# EAGLE design stepstick (EAGLE 5.11)
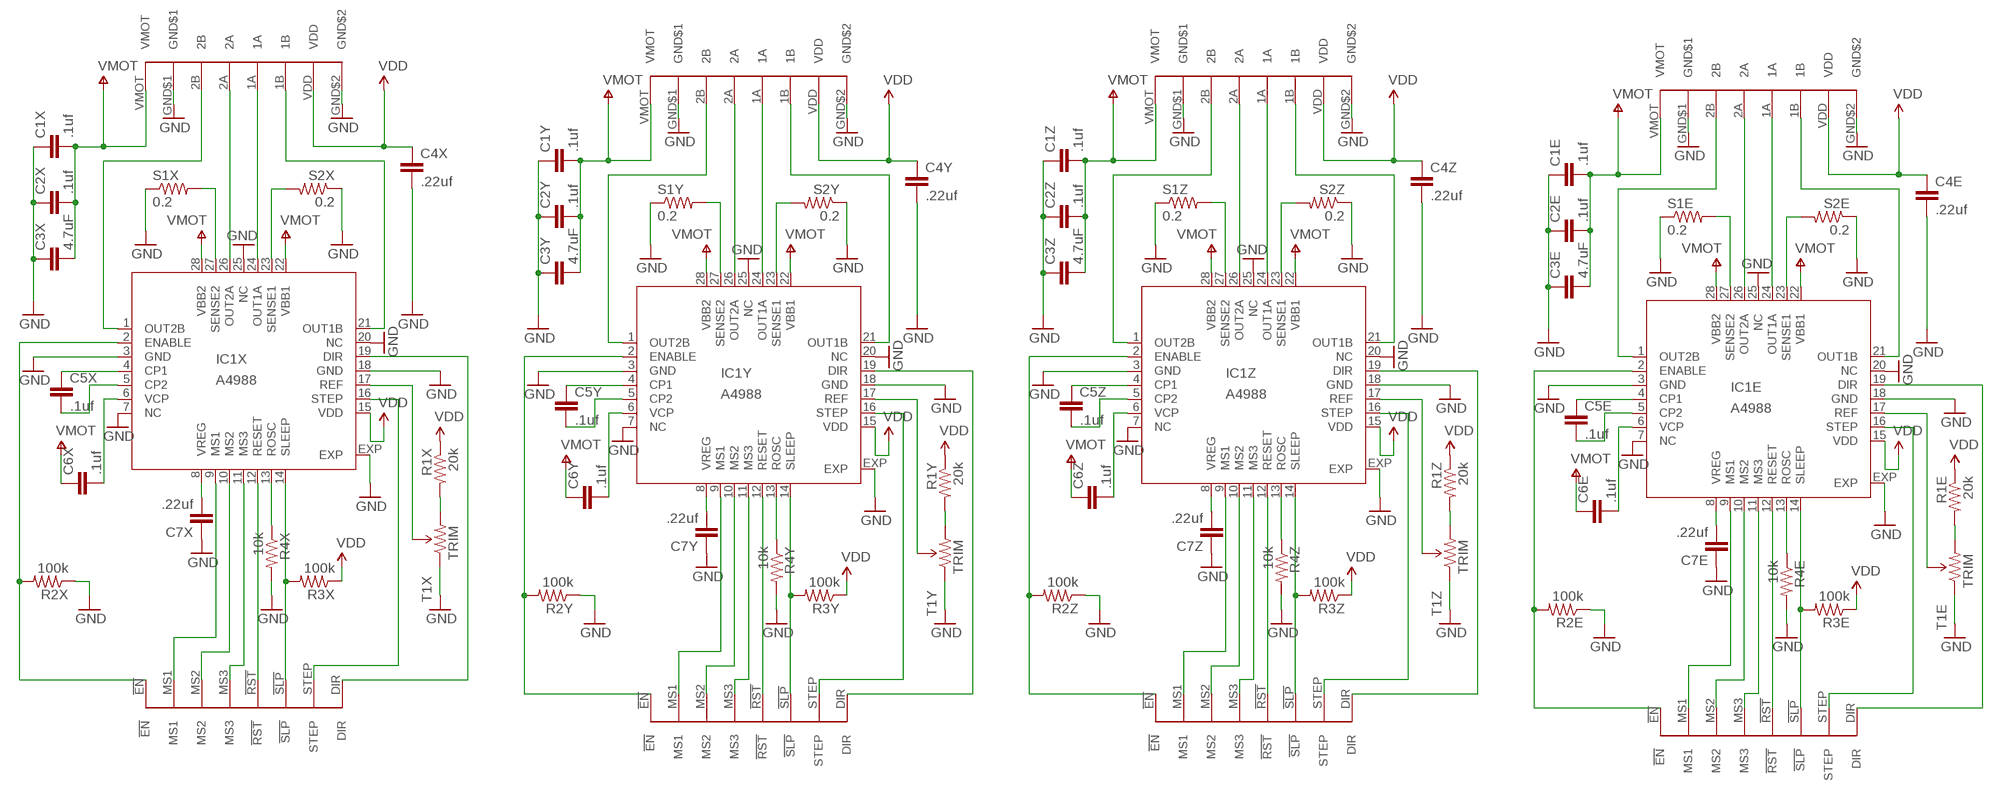
[diagram p0: schematic, sheet 1]

## Parts
C1E  .1uf  CAP0402-CAP  [0402-CAP]
C1X  .1uf  CAP0402-CAP  [0402-CAP]
C1Y  .1uf  CAP0402-CAP  [0402-CAP]
C1Z  .1uf  CAP0402-CAP  [0402-CAP]
C2E  .1uf  CAP0402-CAP  [0402-CAP]
C2X  .1uf  CAP0402-CAP  [0402-CAP]
C2Y  .1uf  CAP0402-CAP  [0402-CAP]
C2Z  .1uf  CAP0402-CAP  [0402-CAP]
C3E  4.7uF  CAP1206  [1206]
C3X  4.7uF  CAP1206  [1206]
C3Y  4.7uF  CAP1206  [1206]
C3Z  4.7uF  CAP1206  [1206]
C4E  .22uf  CAP0402-CAP  [0402-CAP]
C4X  .22uf  CAP0402-CAP  [0402-CAP]
C4Y  .22uf  CAP0402-CAP  [0402-CAP]
C4Z  .22uf  CAP0402-CAP  [0402-CAP]
C5E  .1uf  CAP0402-CAP  [0402-CAP]
C5X  .1uf  CAP0402-CAP  [0402-CAP]
C5Y  .1uf  CAP0402-CAP  [0402-CAP]
C5Z  .1uf  CAP0402-CAP  [0402-CAP]
C6E  .1uf  CAP0402-CAP  [0402-CAP]
C6X  .1uf  CAP0402-CAP  [0402-CAP]
C6Y  .1uf  CAP0402-CAP  [0402-CAP]
C6Z  .1uf  CAP0402-CAP  [0402-CAP]
C7E  .22uf  CAP0402-CAP  [0402-CAP]
C7X  .22uf  CAP0402-CAP  [0402-CAP]
C7Y  .22uf  CAP0402-CAP  [0402-CAP]
C7Z  .22uf  CAP0402-CAP  [0402-CAP]
IC1E  A4988  A4983  [QFN28ET]
IC1X  A4988  A4983  [QFN28ET]
IC1Y  A4988  A4983  [QFN28ET]
IC1Z  A4988  A4983  [QFN28ET]
J1E  CLONOLU  [CLONOLU]
J1X  CLONOLU  [CLONOLU]
J1Y  CLONOLU  [CLONOLU]
J1Z  CLONOLU  [CLONOLU]
R1E  20k  RESISTOR0402-RES  [0402-RES]
R1X  20k  RESISTOR0402-RES  [0402-RES]
R1Y  20k  RESISTOR0402-RES  [0402-RES]
R1Z  20k  RESISTOR0402-RES  [0402-RES]
R2E  100k  RESISTOR0402-RES  [0402-RES]
R2X  100k  RESISTOR0402-RES  [0402-RES]
R2Y  100k  RESISTOR0402-RES  [0402-RES]
R2Z  100k  RESISTOR0402-RES  [0402-RES]
R3E  100k  RESISTOR0402-RES  [0402-RES]
R3X  100k  RESISTOR0402-RES  [0402-RES]
R3Y  100k  RESISTOR0402-RES  [0402-RES]
R3Z  100k  RESISTOR0402-RES  [0402-RES]
R4E  10k  RESISTOR0402-RES  [0402-RES]
R4X  10k  RESISTOR0402-RES  [0402-RES]
R4Y  10k  RESISTOR0402-RES  [0402-RES]
R4Z  10k  RESISTOR0402-RES  [0402-RES]
S1E  0.2  RESISTOR  [0805]
S1X  0.2  RESISTOR  [0805]
S1Y  0.2  RESISTOR  [0805]
S1Z  0.2  RESISTOR  [0805]
S2E  0.2  RESISTOR  [0805]
S2X  0.2  RESISTOR  [0805]
S2Y  0.2  RESISTOR  [0805]
S2Z  0.2  RESISTOR  [0805]
T1E  TRIM  TRIMPOTSMD  [TRIMPOT-3MM]
T1X  TRIM  TRIMPOTSMD  [TRIMPOT-3MM]
T1Y  TRIM  TRIMPOTSMD  [TRIMPOT-3MM]
T1Z  TRIM  TRIMPOTSMD  [TRIMPOT-3MM]

## Nets
ECP1: C5E.1 IC1E.4(CP1)
ECP2: C5E.2 IC1E.5(CP2)
EDIR: IC1E.19(DIR) J1E.DIR(A4983$1:DIR)
EENABLE: IC1E.2(ENABLE) J1E.!EN(A4983$1:!EN) R2E.2
EMS1: IC1E.9(MS1) J1E.MS1(A4983$1:MS1)
EMS2: IC1E.10(MS2) J1E.MS2(A4983$1:MS2)
EMS3: IC1E.11(MS3) J1E.MS3(A4983$1:MS3)
EOUT1A: IC1E.24(OUT1A) J1E.1A(A4983$2:1A)
EOUT1B: IC1E.21(OUT1B) J1E.1B(A4983$2:1B)
EOUT2A: IC1E.26(OUT2A) J1E.2A(A4983$2:2A)
EOUT2B: IC1E.1(OUT2B) J1E.2B(A4983$2:2B)
EREF: IC1E.17(REF) T1E.2(WIPER)
EREF2: R1E.2 T1E.3(CW)
ERESET: IC1E.12(RESET) J1E.!RST(A4983$1:!RST)
EROSC: IC1E.13(ROSC) R4E.1
ESENSE1: IC1E.23(SENSE1) S2E.2
ESENSE2: IC1E.27(SENSE2) S1E.2
ESLEEP: IC1E.14(SLEEP) J1E.!SLP(A4983$1:!SLP) R3E.2
ESTEP: IC1E.16(STEP) J1E.STEP(A4983$1:STEP)
EVCP: C6E.2 IC1E.6(VCP)
EVREG: C7E.2 IC1E.8(VREG)
GND: C1E.1 C1X.1 C1Y.1 C1Z.1 C2E.1 C2X.1 C2Y.1 C2Z.1 C3E.1 C3X.1 C3Y.1 C3Z.1 C4E.2 C4X.2 C4Y.2 C4Z.2 C7E.1 C7X.1 C7Y.1 C7Z.1 IC1E.3(GND) IC1E.7(NC) IC1E.18(GND) IC1E.20(NC) IC1E.25(NC) IC1E.EXP IC1X.3(GND) IC1X.7(NC) IC1X.18(GND) IC1X.20(NC) IC1X.25(NC) IC1X.EXP IC1Y.3(GND) IC1Y.7(NC) IC1Y.18(GND) IC1Y.20(NC) IC1Y.25(NC) IC1Y.EXP IC1Z.3(GND) IC1Z.7(NC) IC1Z.18(GND) IC1Z.20(NC) IC1Z.25(NC) IC1Z.EXP J1E.GND$1(A4983$2:GND$1) J1E.GND$2(A4983$2:GND$2) J1X.GND$1(A4983$2:GND$1) J1X.GND$2(A4983$2:GND$2) J1Y.GND$1(A4983$2:GND$1) J1Y.GND$2(A4983$2:GND$2) J1Z.GND$1(A4983$2:GND$1) J1Z.GND$2(A4983$2:GND$2) R2E.1 R2X.1 R2Y.1 R2Z.1 R4E.2 R4X.2 R4Y.2 R4Z.2 S1E.1 S1X.1 S1Y.1 S1Z.1 S2E.1 S2X.1 S2Y.1 S2Z.1 T1E.1(CCW) T1X.1(CCW) T1Y.1(CCW) T1Z.1(CCW)
VDD: C4E.1 C4X.1 C4Y.1 C4Z.1 IC1E.15(VDD) IC1X.15(VDD) IC1Y.15(VDD) IC1Z.15(VDD) J1E.VDD(A4983$2:VDD) J1X.VDD(A4983$2:VDD) J1Y.VDD(A4983$2:VDD) J1Z.VDD(A4983$2:VDD) R1E.1 R1X.1 R1Y.1 R1Z.1 R3E.1 R3X.1 R3Y.1 R3Z.1
VMOT: C1E.2 C1X.2 C1Y.2 C1Z.2 C2E.2 C2X.2 C2Y.2 C2Z.2 C3E.2 C3X.2 C3Y.2 C3Z.2 C6E.1 C6X.1 C6Y.1 C6Z.1 IC1E.22(VBB1) IC1E.28(VBB2) IC1X.22(VBB1) IC1X.28(VBB2) IC1Y.22(VBB1) IC1Y.28(VBB2) IC1Z.22(VBB1) IC1Z.28(VBB2) J1E.VMOT(A4983$2:VMOT) J1X.VMOT(A4983$2:VMOT) J1Y.VMOT(A4983$2:VMOT) J1Z.VMOT(A4983$2:VMOT)
XCP1: C5X.1 IC1X.4(CP1)
XCP2: C5X.2 IC1X.5(CP2)
XDIR: IC1X.19(DIR) J1X.DIR(A4983$1:DIR)
XENABLE: IC1X.2(ENABLE) J1X.!EN(A4983$1:!EN) R2X.2
XMS1: IC1X.9(MS1) J1X.MS1(A4983$1:MS1)
XMS2: IC1X.10(MS2) J1X.MS2(A4983$1:MS2)
XMS3: IC1X.11(MS3) J1X.MS3(A4983$1:MS3)
XOUT1A: IC1X.24(OUT1A) J1X.1A(A4983$2:1A)
XOUT1B: IC1X.21(OUT1B) J1X.1B(A4983$2:1B)
XOUT2A: IC1X.26(OUT2A) J1X.2A(A4983$2:2A)
XOUT2B: IC1X.1(OUT2B) J1X.2B(A4983$2:2B)
XOUT2B1: IC1Y.1(OUT2B) J1Y.2B(A4983$2:2B)
XREF: IC1X.17(REF) T1X.2(WIPER)
XREF2: R1X.2 T1X.3(CW)
XRESET: IC1X.12(RESET) J1X.!RST(A4983$1:!RST)
XROSC: IC1X.13(ROSC) R4X.1
XSENSE1: IC1X.23(SENSE1) S2X.2
XSENSE2: IC1X.27(SENSE2) S1X.2
XSLEEP: IC1X.14(SLEEP) J1X.!SLP(A4983$1:!SLP) R3X.2
XSTEP: IC1X.16(STEP) J1X.STEP(A4983$1:STEP)
XVCP: C6X.2 IC1X.6(VCP)
XVREG: C7X.2 IC1X.8(VREG)
YCP1: C5Y.1 IC1Y.4(CP1)
YCP2: C5Y.2 IC1Y.5(CP2)
YDIR1: IC1Y.19(DIR) J1Y.DIR(A4983$1:DIR)
YENABLE: IC1Y.2(ENABLE) J1Y.!EN(A4983$1:!EN) R2Y.2
YMS1: IC1Y.9(MS1) J1Y.MS1(A4983$1:MS1)
YMS2: IC1Y.10(MS2) J1Y.MS2(A4983$1:MS2)
YMS3: IC1Y.11(MS3) J1Y.MS3(A4983$1:MS3)
YOUT1A: IC1Y.24(OUT1A) J1Y.1A(A4983$2:1A)
YOUT1B: IC1Y.21(OUT1B) J1Y.1B(A4983$2:1B)
YOUT2A: IC1Y.26(OUT2A) J1Y.2A(A4983$2:2A)
YREF: IC1Y.17(REF) T1Y.2(WIPER)
YREF1: R1Y.2 T1Y.3(CW)
YRESET: IC1Y.12(RESET) J1Y.!RST(A4983$1:!RST)
YROSC: IC1Y.13(ROSC) R4Y.1
YSENSE1: IC1Y.23(SENSE1) S2Y.2
YSENSE2: IC1Y.27(SENSE2) S1Y.2
YSLEEP: IC1Y.14(SLEEP) J1Y.!SLP(A4983$1:!SLP) R3Y.2
YSTEP: IC1Y.16(STEP) J1Y.STEP(A4983$1:STEP)
YVCP: C6Y.2 IC1Y.6(VCP)
YVREG: C7Y.2 IC1Y.8(VREG)
ZCP1: C5Z.1 IC1Z.4(CP1)
ZCP2: C5Z.2 IC1Z.5(CP2)
ZDIR: IC1Z.19(DIR) J1Z.DIR(A4983$1:DIR)
ZENABLE: IC1Z.2(ENABLE) J1Z.!EN(A4983$1:!EN) R2Z.2
ZMS1: IC1Z.9(MS1) J1Z.MS1(A4983$1:MS1)
ZMS2: IC1Z.10(MS2) J1Z.MS2(A4983$1:MS2)
ZMS3: IC1Z.11(MS3) J1Z.MS3(A4983$1:MS3)
ZOUT1A: IC1Z.24(OUT1A) J1Z.1A(A4983$2:1A)
ZOUT1B: IC1Z.21(OUT1B) J1Z.1B(A4983$2:1B)
ZOUT2A: IC1Z.26(OUT2A) J1Z.2A(A4983$2:2A)
ZOUT2B: IC1Z.1(OUT2B) J1Z.2B(A4983$2:2B)
ZREF: IC1Z.17(REF) T1Z.2(WIPER)
ZREF2: R1Z.2 T1Z.3(CW)
ZRESET: IC1Z.12(RESET) J1Z.!RST(A4983$1:!RST)
ZROSC: IC1Z.13(ROSC) R4Z.1
ZSENSE1: IC1Z.23(SENSE1) S2Z.2
ZSENSE2: IC1Z.27(SENSE2) S1Z.2
ZSLEEP: IC1Z.14(SLEEP) J1Z.!SLP(A4983$1:!SLP) R3Z.2
ZSTEP: IC1Z.16(STEP) J1Z.STEP(A4983$1:STEP)
ZVCP: C6Z.2 IC1Z.6(VCP)
ZVREG: C7Z.2 IC1Z.8(VREG)

## Library data of the parts
C1E C1X C1Y C1Z C2E C2X C2Y C2Z C3E C3X C3Y C3Z C4E C4X C4Y C4Z C5E C5X C5Y C5Z C6E C6X C6Y C6Z C7E C7X C7Y C7Z = SparkFun:CAP: Capacitor Standard 0603 ceramic capacitor, and 0.1" leaded capacitor.
IC1E IC1X IC1Y IC1Z = allegro:A4983: DMOS Microstepping Driver with Translator Auto generated by make-symbol-device-package-bsdl.ulp Rev. 32 Source: http://www.allegromicro.com/en/Products/Part_Numbers/4983/4983.pdf; MPN: A4983SETTR-T; OC_FARNELL: 1688956; OC_NEWARK: 39M6763
J1E J1X J1Y J1Z = pololu-allegro:CLONOLU
R1E R1X R1Y R1Z R2E R2X R2Y R2Z R3E R3X R3Y R3Z R4E R4X R4Y R4Z S1E S1X S1Y S1Z S2E S2X S2Y S2Z = SparkFun:RESISTOR: Resistor Basic schematic elements and footprints for 0603, 1206, and PTH 1/10th watt (small) resistors.
T1E T1X T1Y T1Z = SparkFun:TRIMPOT

## Board
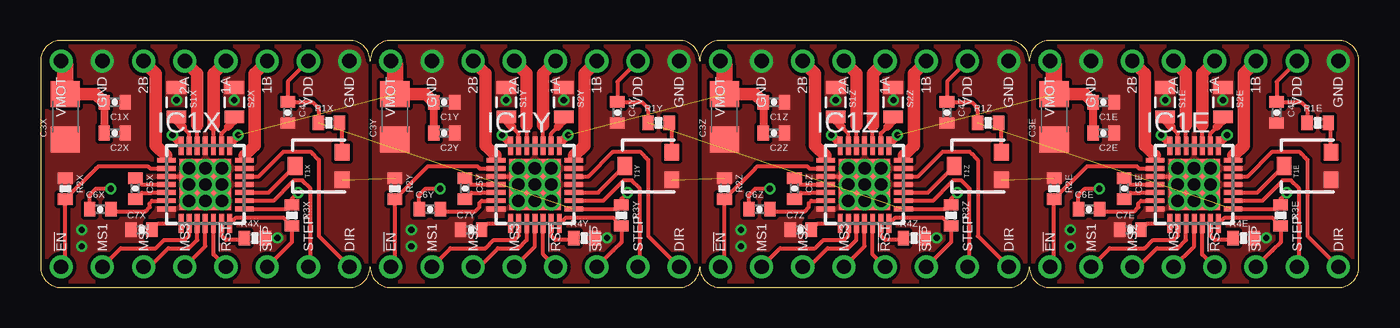
[diagram p1: board, top side]
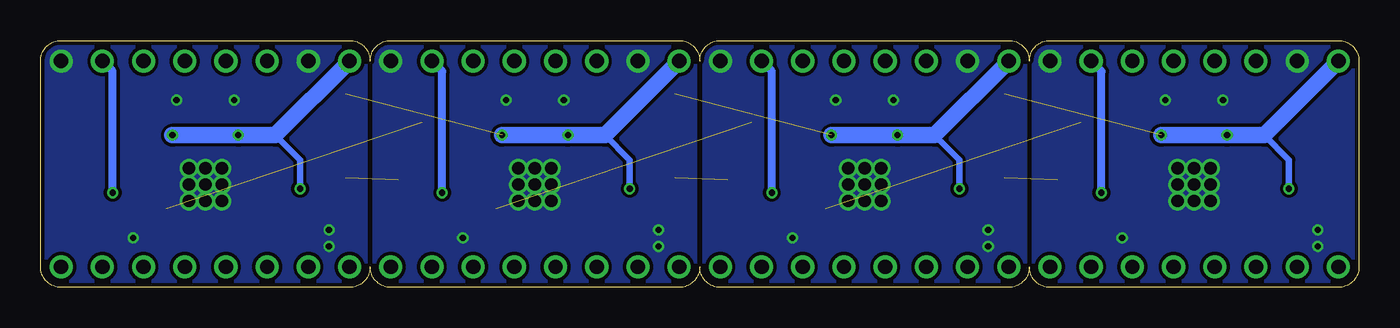
[diagram p2: board, bottom side, seen from below]

Size 81.28 x 15.24 mm. Coordinates in mm from the lower left corner, seen from the top.
Outline: 1.27,15.24 arc90 0,13.97 0,1.27 arc90 1.27,0 19.05,0 arc90 20.32,1.27 arc90 21.59,0 39.37,0 arc90 40.64,1.27 arc90 41.91,0 59.69,0 arc90 60.96,1.27 arc90 62.23,0 80.01,0 arc90 81.28,1.27 81.28,13.97 arc90 80.01,15.24 62.23,15.24 arc90 60.96,13.97 arc90 59.69,15.24 41.91,15.24 arc90 40.64,13.97 arc90 39.37,15.24 21.59,15.24 arc90 20.32,13.97 arc90 19.05,15.24 1.27,15.24
Copper layers (1*16): Top 0.035mm / dielectric 1.5mm / Bottom 0.035mm
Design rules "ITead_rule *": minimum track width 8mil, minimum drill 12mil, track to track 8mil, track to pad 8mil, pad to pad 7mil, via to via 8mil, smd to smd 0mil, copper to edge 10mil, drill to drill 10mil, minimum pad ring 10mil, minimum via ring 6mil, stop-mask expansion 2mil, vias tented up to drill 100mil, thermal gap 10mil

### Footprints (pad centres in the part's own frame; a part is rotated, then mirrored left to right if it is on the bottom)
0402-CAP = smd 0.7 x 0.9: 1 -0.65,0; 2 0.65,0
1206 = smd 1.6 x 1.8: 1 -1.4,0; 2 1.4,0
QFN28ET = smd 1.15 x 0.3: 1 -2.4,1.5; 2 -2.4,1; 3 -2.4,0.5; 4 -2.4,0; 5 -2.4,-0.5; 6 -2.4,-1; 7 -2.4,-1.5; 15 2.4,-1.5; 16 2.4,-1; 17 2.4,-0.5; 18 2.4,0; 19 2.4,0.5; 20 2.4,1; 21 2.4,1.5 | smd 0.3 x 1.15: 8 -1.5,-2.4; 9 -1,-2.4; 10 -0.5,-2.4; 11 0,-2.4; 12 0.5,-2.4; 13 1,-2.4; 14 1.5,-2.4; 22 1.5,2.4; 23 1,2.4; 24 0.5,2.4; 25 0,2.4; 26 -0.5,2.4; 27 -1,2.4; 28 -1.5,2.4 | smd 3.15 x 3.15: EXP 0,0
CLONOLU = drill 0.889 pad 1.422 round: 1A 6.35,-1.27; 1B 6.35,-3.81; 2A 6.35,1.27; 2B 6.35,3.81; !EN -6.35,8.89; !RST -6.35,-1.27; !SLP -6.35,-3.81; DIR -6.35,-8.89; GND$1 6.35,6.35; GND$2 6.35,-8.89; MS1 -6.35,6.35; MS2 -6.35,3.81; MS3 -6.35,1.27; STEP -6.35,-6.35; VDD 6.35,-6.35; VMOT 6.35,8.89
0402-RES = smd 0.7 x 0.9: 1 -0.65,0; 2 0.65,0
0805 = smd 0.8 x 1.2: 1 -0.9,0; 2 0.9,0
TRIMPOT-3MM = smd 1 x 0.9: 1 -0.85,-1.45; 3 0.85,-1.45 | smd 1.1 x 0.9: 2 0,1.45

### Placement (x,y rotation side)
C1E  65.53,11.43 180 top
C1X  4.57,11.43 180 top
C1Y  24.89,11.43 180 top
C1Z  45.21,11.43 180 top
C2E  65.53,9.53 180 top
C2X  4.57,9.53 180 top
C2Y  24.89,9.53 180 top
C2Z  45.21,9.53 180 top
C3E  62.48,10.54 90 top
C3X  1.52,10.54 90 top
C3Y  21.84,10.54 90 top
C3Z  42.16,10.54 90 top
C4E  76.2,10.79 270 top
C4X  15.24,10.79 270 top
C4Y  35.56,10.79 270 top
C4Z  55.88,10.79 270 top
C5E  66.8,6.1 270 top
C5X  5.84,6.1 270 top
C5Y  26.16,6.1 270 top
C5Z  46.48,6.1 270 top
C6E  64.64,4.83 0 top
C6X  3.68,4.83 0 top
C6Y  24,4.83 0 top
C6Z  44.32,4.83 0 top
C7E  67.18,3.56 0 top
C7X  6.22,3.56 0 top
C7Y  26.54,3.56 0 top
C7Z  46.86,3.56 0 top
IC1E  71.12,6.35 0 top
IC1X  10.16,6.35 0 top
IC1Y  30.48,6.35 0 top
IC1Z  50.8,6.35 0 top
J1E  71.12,7.62 90 top
J1X  10.16,7.62 90 top
J1Y  30.48,7.62 90 top
J1Z  50.8,7.62 90 top
R1E  78.74,10.16 0 top
R1X  17.78,10.16 0 top
R1Y  38.1,10.16 0 top
R1Z  58.42,10.16 0 top
R2E  62.48,6.1 270 top
R2X  1.52,6.1 270 top
R2Y  21.84,6.1 270 top
R2Z  42.16,6.1 270 top
R3E  76.45,4.45 270 top
R3X  15.49,4.45 270 top
R3Y  35.81,4.45 270 top
R3Z  56.13,4.45 270 top
R4E  74.17,3.05 0 top
R4X  13.21,3.05 0 top
R4Y  33.53,3.05 0 top
R4Z  53.85,3.05 0 top
S1E  69.34,11.43 270 top
S1X  8.38,11.43 270 top
S1Y  28.7,11.43 270 top
S1Z  49.02,11.43 270 top
S2E  72.9,11.43 270 top
S2X  11.94,11.43 270 top
S2Y  32.26,11.43 270 top
S2Z  52.58,11.43 270 top
T1E  78.11,7.49 90 top
T1X  17.14,7.49 90 top
T1Y  37.47,7.49 90 top
T1Z  57.78,7.49 90 top

### Tracks (layer width: path | path; a pad name or v marks a point on that pad's centre or on a via)
ECP1
  Top 0.254: IC1E.4 67.2,6.35 C5E.1
ECP2
  Top 0.254: IC1E.5 67.83,5.85 67.82,5.84 67.2,5.84 C5E.2
EDIR
  Top 0.254: IC1E.19 74.41,6.85 75.95,8.38 77.6,8.38 77.72,8.26 77.98,8 78.11,7.87 78.11,3.17 J1E.DIR
EENABLE
  Top 0.254: J1E.!EN 62.48,1.52 R2E.2 64.39,7.35 64.53,7.49 67.56,7.49 67.71,7.35 IC1E.2
EMS1
  Top 0.254: IC1E.9 70.12,3.19 69.85,2.92 68.58,2.92 68.07,2.41 65.91,2.41 J1E.MS1
EMS2
  Top 0.254: J1E.MS2 67.69,1.27 68.83,2.41 70.1,2.41 70.61,2.92 70.62,2.93 IC1E.10
EMS3
  Top 0.254: J1E.MS3 71.12,2.54 IC1E.11
EOUT1A
  Top 0.254: IC1E.24 71.62,9.9 71.63,10.03
  Top 0.762: J1E.1A 71.63,13.21 71.63,10.03
EOUT1B
  Top 0.254: 73.53,8.13 73.53,7.86 IC1E.21
  Top 0.762: J1E.1B 74.17,13.21 74.17,8.76 73.53,8.13
EOUT2A
  Top 0.254: IC1E.26 70.62,9.9 70.61,10.03
  Top 0.762: J1E.2A 70.61,13.21 70.61,10.03
EOUT2B
  Top 0.254: 68.71,8.13 68.71,7.86 IC1E.1
  Top 0.762: J1E.2B 68.07,13.21 68.07,8.76 68.71,8.13
EREF
  Top 0.254: IC1E.17 75.01,5.85 T1E.2
EREF2
  Top 0.254: T1E.3 79.56,9.99 R1E.2
ERESET
  Top 0.254: J1E.!RST 71.62,2.04 IC1E.12
EROSC
  Top 0.254: IC1E.13 72.12,3.19 72.39,2.92 73.39,2.92 R4E.1
ESENSE1
  Top 0.254: IC1E.23 72.12,9.51 72.52,9.91
  Top 0.508: 72.52,9.91 72.9,10.29 S2E.2
ESENSE2
  Top 0.254: IC1E.27 70.12,9.51 69.72,9.91
  Top 0.508: 69.72,9.91 69.34,10.29 S1E.2
ESLEEP
  Top 0.254: J1E.!SLP 75.95,2.29 76.45,2.79 R3E.2 75.93,4.32 73.03,4.32 72.66,3.95 IC1E.14
ESTEP
  Top 0.254: IC1E.16 75.33,5.35 76.45,6.48 76.58,6.6 77.09,6.6 77.6,6.1 77.6,5.97 77.6,1.4 J1E.STEP
EVCP
  Top 0.254: IC1E.6 67.83,5.35 67.69,5.21 67.69,4.95 67.44,4.7 65.42,4.7 C6E.2
EVREG
  Top 0.254: IC1E.8 68.23,3.95 C7E.2
GND  (via drill 0.38, 0.76)  (3 unrouted)
  Top 0.254: IC1X.3 8.64,6.85 arc-90 v9.14,6.35 | IC1Y.3 28.96,6.85 arc-90 v29.46,6.35 | IC1Z.3 49.28,6.85 arc-90 v49.78,6.35 | IC1E.3 69.6,6.85 arc-90 v70.1,6.35
  other vias: 8.38,11.56 11.94,11.56 10.16,7.37 9.14,7.37 11.18,7.37 11.18,5.33 9.14,5.33 10.16,6.35 11.18,6.35 10.16,5.33 14.61,3.05 2.54,2.54 28.7,11.56 32.26,11.56 30.48,7.37 29.46,7.37 31.5,7.37 31.5,5.33 29.46,5.33 30.48,6.35 31.5,6.35 30.48,5.33 34.92,3.05 49.02,11.56 52.58,11.56 50.8,7.37 49.78,7.37 51.82,7.37 51.82,5.33 49.78,5.33 50.8,6.35 51.82,6.35 50.8,5.33 55.24,3.05 69.34,11.56 72.9,11.56 71.12,7.37 70.1,7.37 72.14,7.37 72.14,5.33 70.1,5.33 71.12,6.35 72.14,6.35 71.12,5.33 75.56,3.05 2.54,3.56 22.86,2.54 22.86,3.56 43.18,2.54 43.18,3.56 63.5,2.54 63.5,3.56
  pour Top (rank 6, no thermals): 0,15.24 20.07,15.24 20.07,0 0,0
  pour Top (rank 6, no thermals): 20.57,15.24 40.39,15.24 40.39,0 20.57,0
  pour Top (rank 6, no thermals): 40.89,15.24 60.71,15.24 60.71,0 40.89,0
  pour Top (rank 6, no thermals): 61.21,15.24 81.28,15.24 81.28,0 61.21,0
  pour Bottom (rank 6, no thermals): 0,15.24 20.07,15.24 20.07,0 0,0
  pour Bottom (rank 6, no thermals): 20.57,15.24 40.39,15.24 40.39,0 20.57,0
  pour Bottom (rank 6, no thermals): 40.89,15.24 60.71,15.24 60.71,0 40.89,0
  pour Bottom (rank 6, no thermals): 61.21,15.24 81.28,15.24 81.28,0 61.21,0
VDD  (via drill 0.38)  (3 unrouted)
  Top 0.254: IC1X.15 15.25,4.85 R3X.1 15.49,5.46 v15.88,5.84 | R1X.1 17.13,11.06 16.76,11.43 15.26,11.43 C4X.1 15.24,12.7 J1X.VDD | IC1E.15 76.21,4.85 R3E.1 76.45,5.46 v76.83,5.84 | R1E.1 78.09,11.06 77.72,11.43 76.22,11.43 C4E.1 76.2,12.7 J1E.VDD | IC1Z.15 55.89,4.85 R3Z.1 56.13,5.46 v56.52,5.84 | R1Z.1 57.77,11.06 57.4,11.43 55.9,11.43 C4Z.1 55.88,12.7 J1Z.VDD | IC1Y.15 35.57,4.85 R3Y.1 35.81,5.46 v36.2,5.84 | R1Y.1 37.45,11.06 37.08,11.43 35.58,11.43 C4Y.1 35.56,12.7 J1Y.VDD
  Bottom 0.508: v15.88,5.84 15.88,13.34 J1X.VDD | v76.83,5.84 76.83,13.34 J1E.VDD | v56.52,5.84 56.52,13.34 J1Z.VDD | v36.2,5.84 36.2,13.34 J1Y.VDD
VMOT  (via drill 0.38)  (3 unrouted)
  Top 0.254: 8.51,9.02 8.65,8.76 IC1X.28 | 11.81,9.02 11.67,8.76 IC1X.22 | C6X.1 3.03,5.7 3.43,6.1 v4.32,6.1 | 28.83,9.02 28.97,8.76 IC1Y.28 | 32.13,9.02 31.99,8.76 IC1Y.22 | C6Y.1 23.35,5.7 23.75,6.1 v24.64,6.1 | 49.15,9.02 49.29,8.76 IC1Z.28 | 52.45,9.02 52.31,8.76 IC1Z.22 | C6Z.1 43.67,5.7 44.07,6.1 v44.96,6.1 | 69.47,9.02 69.61,8.76 IC1E.28 | 72.77,9.02 72.63,8.76 IC1E.22 | C6E.1 63.99,5.7 64.39,6.1 v65.28,6.1
  Top 0.508: v8.13,9.4 8.51,9.02 | v12.19,9.4 11.81,9.02 | C1X.2 C2X.2 3.94,9.51 | v28.45,9.4 28.83,9.02 | v32.51,9.4 32.13,9.02 | C1Y.2 C2Y.2 24.26,9.51 | v48.77,9.4 49.15,9.02 | v52.83,9.4 52.45,9.02 | C1Z.2 C2Z.2 44.58,9.51 | v69.09,9.4 69.47,9.02 | v73.15,9.4 72.77,9.02 | C1E.2 C2E.2 64.9,9.51
  Top 0.762: C1X.2 3.41,11.94 C3X.2 | C1Y.2 23.73,11.94 C3Y.2 | C1Z.2 44.05,11.94 C3Z.2 | C1E.2 64.37,11.94 C3E.2
  Top 1.016: C3Y.2 21.84,13.72 J1Y.VMOT | C3Z.2 42.16,13.72 J1Z.VMOT | C3E.2 62.48,13.72 J1E.VMOT | C3X.2 1.52,13.72 J1X.VMOT
  Bottom 0.406: v4.32,6.1 4.32,7.87 5.84,9.4 | v24.64,6.1 24.64,7.87 26.16,9.4 | v44.96,6.1 44.96,7.87 46.48,9.4 | v65.28,6.1 65.28,7.87 66.8,9.4
  Bottom 1.016: v12.19,9.4 v8.13,9.4 5.84,9.4 J1X.VMOT | v32.51,9.4 v28.45,9.4 26.16,9.4 J1Y.VMOT | v52.83,9.4 v48.77,9.4 46.48,9.4 J1Z.VMOT | v73.15,9.4 v69.09,9.4 66.8,9.4 J1E.VMOT
XCP1
  Top 0.254: IC1X.4 6.24,6.35 C5X.1
XCP2
  Top 0.254: IC1X.5 6.87,5.85 6.86,5.84 6.24,5.84 C5X.2
XDIR
  Top 0.254: IC1X.19 13.45,6.85 14.99,8.38 16.64,8.38 16.76,8.26 17.02,8 17.14,7.87 17.14,3.17 J1X.DIR
XENABLE
  Top 0.254: J1X.!EN 1.52,1.52 R2X.2 3.43,7.35 3.57,7.49 6.6,7.49 6.75,7.35 IC1X.2
XMS1
  Top 0.254: IC1X.9 9.16,3.19 8.89,2.92 7.62,2.92 7.11,2.41 4.95,2.41 J1X.MS1
XMS2
  Top 0.254: J1X.MS2 6.73,1.27 7.87,2.41 9.14,2.41 9.65,2.92 9.66,2.93 IC1X.10
XMS3
  Top 0.254: J1X.MS3 10.16,2.54 IC1X.11
XOUT1A
  Top 0.254: IC1X.24 10.66,9.9 10.67,10.03
  Top 0.762: J1X.1A 10.67,13.21 10.67,10.03
XOUT1B
  Top 0.254: 12.57,8.13 12.57,7.86 IC1X.21
  Top 0.762: J1X.1B 13.21,13.21 13.21,8.76 12.57,8.13
XOUT2A
  Top 0.254: IC1X.26 9.66,9.9 9.65,10.03
  Top 0.762: J1X.2A 9.65,13.21 9.65,10.03
XOUT2B
  Top 0.254: 7.75,8.13 7.75,7.86 IC1X.1
  Top 0.762: J1X.2B 7.11,13.21 7.11,8.76 7.75,8.13
XOUT2B1
  Top 0.254: 28.07,8.13 28.07,7.86 IC1Y.1
  Top 0.762: J1Y.2B 27.43,13.21 27.43,8.76 28.07,8.13
XREF
  Top 0.254: IC1X.17 14.05,5.85 T1X.2
XREF2
  Top 0.254: T1X.3 18.59,9.99 R1X.2
XRESET
  Top 0.254: J1X.!RST 10.66,2.04 IC1X.12
XROSC
  Top 0.254: IC1X.13 11.16,3.19 11.43,2.92 12.43,2.92 R4X.1
XSENSE1
  Top 0.254: IC1X.23 11.16,9.51 11.56,9.91
  Top 0.508: 11.56,9.91 11.94,10.29 S2X.2
XSENSE2
  Top 0.254: IC1X.27 9.16,9.51 8.76,9.91
  Top 0.508: 8.76,9.91 8.38,10.29 S1X.2
XSLEEP
  Top 0.254: J1X.!SLP 14.99,2.29 15.49,2.79 R3X.2 14.97,4.32 12.06,4.32 11.7,3.95 IC1X.14
XSTEP
  Top 0.254: IC1X.16 14.37,5.35 15.49,6.48 15.62,6.6 16.13,6.6 16.64,6.1 16.64,5.97 16.64,1.4 J1X.STEP
XVCP
  Top 0.254: IC1X.6 6.87,5.35 6.73,5.21 6.73,4.95 6.48,4.7 4.46,4.7 C6X.2
XVREG
  Top 0.254: IC1X.8 7.27,3.95 C7X.2
YCP1
  Top 0.254: IC1Y.4 26.56,6.35 C5Y.1
YCP2
  Top 0.254: IC1Y.5 27.19,5.85 27.18,5.84 26.56,5.84 C5Y.2
YDIR1
  Top 0.254: IC1Y.19 33.77,6.85 35.31,8.38 36.96,8.38 37.08,8.26 37.34,8 37.47,7.87 37.47,3.17 J1Y.DIR
YENABLE
  Top 0.254: J1Y.!EN 21.84,1.52 R2Y.2 23.75,7.35 23.89,7.49 26.92,7.49 27.07,7.35 IC1Y.2
YMS1
  Top 0.254: IC1Y.9 29.48,3.19 29.21,2.92 27.94,2.92 27.43,2.41 25.27,2.41 J1Y.MS1
YMS2
  Top 0.254: J1Y.MS2 27.05,1.27 28.19,2.41 29.46,2.41 29.97,2.92 29.98,2.93 IC1Y.10
YMS3
  Top 0.254: J1Y.MS3 30.48,2.54 IC1Y.11
YOUT1A
  Top 0.254: IC1Y.24 30.98,9.9 30.99,10.03
  Top 0.762: J1Y.1A 30.99,13.21 30.99,10.03
YOUT1B
  Top 0.254: 32.89,8.13 32.89,7.86 IC1Y.21
  Top 0.762: J1Y.1B 33.53,13.21 33.53,8.76 32.89,8.13
YOUT2A
  Top 0.254: IC1Y.26 29.98,9.9 29.97,10.03
  Top 0.762: J1Y.2A 29.97,13.21 29.97,10.03
YREF
  Top 0.254: IC1Y.17 34.37,5.85 T1Y.2
YREF1
  Top 0.254: T1Y.3 38.91,9.99 R1Y.2
YRESET
  Top 0.254: J1Y.!RST 30.98,2.04 IC1Y.12
YROSC
  Top 0.254: IC1Y.13 31.48,3.19 31.75,2.92 32.75,2.92 R4Y.1
YSENSE1
  Top 0.254: IC1Y.23 31.48,9.51 31.88,9.91
  Top 0.508: 31.88,9.91 32.26,10.29 S2Y.2
YSENSE2
  Top 0.254: IC1Y.27 29.48,9.51 29.08,9.91
  Top 0.508: 29.08,9.91 28.7,10.29 S1Y.2
YSLEEP
  Top 0.254: J1Y.!SLP 35.31,2.29 35.81,2.79 R3Y.2 35.29,4.32 32.38,4.32 32.02,3.95 IC1Y.14
YSTEP
  Top 0.254: IC1Y.16 34.69,5.35 35.81,6.48 35.94,6.6 36.45,6.6 36.96,6.1 36.96,5.97 36.96,1.4 J1Y.STEP
YVCP
  Top 0.254: IC1Y.6 27.19,5.35 27.05,5.21 27.05,4.95 26.8,4.7 24.78,4.7 C6Y.2
YVREG
  Top 0.254: IC1Y.8 27.59,3.95 C7Y.2
ZCP1
  Top 0.254: IC1Z.4 46.88,6.35 C5Z.1
ZCP2
  Top 0.254: IC1Z.5 47.51,5.85 47.5,5.84 46.88,5.84 C5Z.2
ZDIR
  Top 0.254: IC1Z.19 54.09,6.85 55.63,8.38 57.28,8.38 57.4,8.26 57.66,8 57.78,7.87 57.78,3.17 J1Z.DIR
ZENABLE
  Top 0.254: J1Z.!EN 42.16,1.52 R2Z.2 44.07,7.35 44.21,7.49 47.24,7.49 47.39,7.35 IC1Z.2
ZMS1
  Top 0.254: IC1Z.9 49.8,3.19 49.53,2.92 48.26,2.92 47.75,2.41 45.59,2.41 J1Z.MS1
ZMS2
  Top 0.254: J1Z.MS2 47.37,1.27 48.51,2.41 49.78,2.41 50.29,2.92 50.3,2.93 IC1Z.10
ZMS3
  Top 0.254: J1Z.MS3 50.8,2.54 IC1Z.11
ZOUT1A
  Top 0.254: IC1Z.24 51.3,9.9 51.31,10.03
  Top 0.762: J1Z.1A 51.31,13.21 51.31,10.03
ZOUT1B
  Top 0.254: 53.21,8.13 53.21,7.86 IC1Z.21
  Top 0.762: J1Z.1B 53.85,13.21 53.85,8.76 53.21,8.13
ZOUT2A
  Top 0.254: IC1Z.26 50.3,9.9 50.29,10.03
  Top 0.762: J1Z.2A 50.29,13.21 50.29,10.03
ZOUT2B
  Top 0.254: 48.39,8.13 48.39,7.86 IC1Z.1
  Top 0.762: J1Z.2B 47.75,13.21 47.75,8.76 48.39,8.13
ZREF
  Top 0.254: IC1Z.17 54.69,5.85 T1Z.2
ZREF2
  Top 0.254: T1Z.3 59.23,9.99 R1Z.2
ZRESET
  Top 0.254: J1Z.!RST 51.3,2.04 IC1Z.12
ZROSC
  Top 0.254: IC1Z.13 51.8,3.19 52.07,2.92 53.07,2.92 R4Z.1
ZSENSE1
  Top 0.254: IC1Z.23 51.8,9.51 52.2,9.91
  Top 0.508: 52.2,9.91 52.58,10.29 S2Z.2
ZSENSE2
  Top 0.254: IC1Z.27 49.8,9.51 49.4,9.91
  Top 0.508: 49.4,9.91 49.02,10.29 S1Z.2
ZSLEEP
  Top 0.254: J1Z.!SLP 55.63,2.29 56.13,2.79 R3Z.2 55.61,4.32 52.7,4.32 52.34,3.95 IC1Z.14
ZSTEP
  Top 0.254: IC1Z.16 55.01,5.35 56.13,6.48 56.26,6.6 56.77,6.6 57.28,6.1 57.28,5.97 57.28,1.4 J1Z.STEP
ZVCP
  Top 0.254: IC1Z.6 47.51,5.35 47.37,5.21 47.37,4.95 47.12,4.7 45.1,4.7 C6Z.2
ZVREG
  Top 0.254: IC1Z.8 47.91,3.95 C7Z.2

### Text on the board
_tsilk: C1X | S1X | S2X | C1Y | S1Y | S2Y | C1Z | S1Z | S2Z | C1E | S1E | S2E | C4X | R1X | C4Y | R1Y | C4Z | R1Z | C4E | R1E | C3X | Rev 0.1 | C3Y | Rev 0.1 | C3Z | Rev 0.1 | C3E | Rev 0.1 | C2X | C2Y | C2Z | C2E | R2X | C5X | T1X | R2Y | C5Y | T1Y | R2Z | C5Z | T1Z | R2E | C5E | T1X | R3X | R3Y | R3Z | R3E | C6X | StepStick | C6Y | StepStick | C6Z | StepStick | C6E | StepStick | C7X | A4988 | C7Y | A4988 | C7Z | A4988 | C7E | A4988 | R4X | R4Y | R4Z | R4E
_bsilk: VMOT | GND | 2B | 2A | 1A | 1B | VDD | GND | VMOT | GND | 2B | 2A | 1A | 1B | VDD | GND | VMOT | GND | 2B | 2A | 1A | 1B | VDD | GND | VMOT | GND | 2B | 2A | 1A | 1B | VDD | GND | reprap.org/wiki/stepstick | reprap.org/wiki/stepstick | reprap.org/wiki/stepstick | reprap.org/wiki/stepstick | !ENABLE | MS1 | MS2 | MS3 | !RESET | !SLEEP | STEP | DIRECTION | !ENABLE | MS1 | MS2 | MS3 | !RESET | !SLEEP | STEP | DIRECTION | !ENABLE | MS1 | MS2 | MS3 | !RESET | !SLEEP | STEP | DIRECTION | !ENABLE | MS1 | MS2 | MS3 | !RESET | !SLEEP | STEP | DIRECTION